# Altium schematic sheet down_converter_RF.SchDoc
size A3; DocumentNumber: 16; SheetNumber: 16; SheetTotal: 19
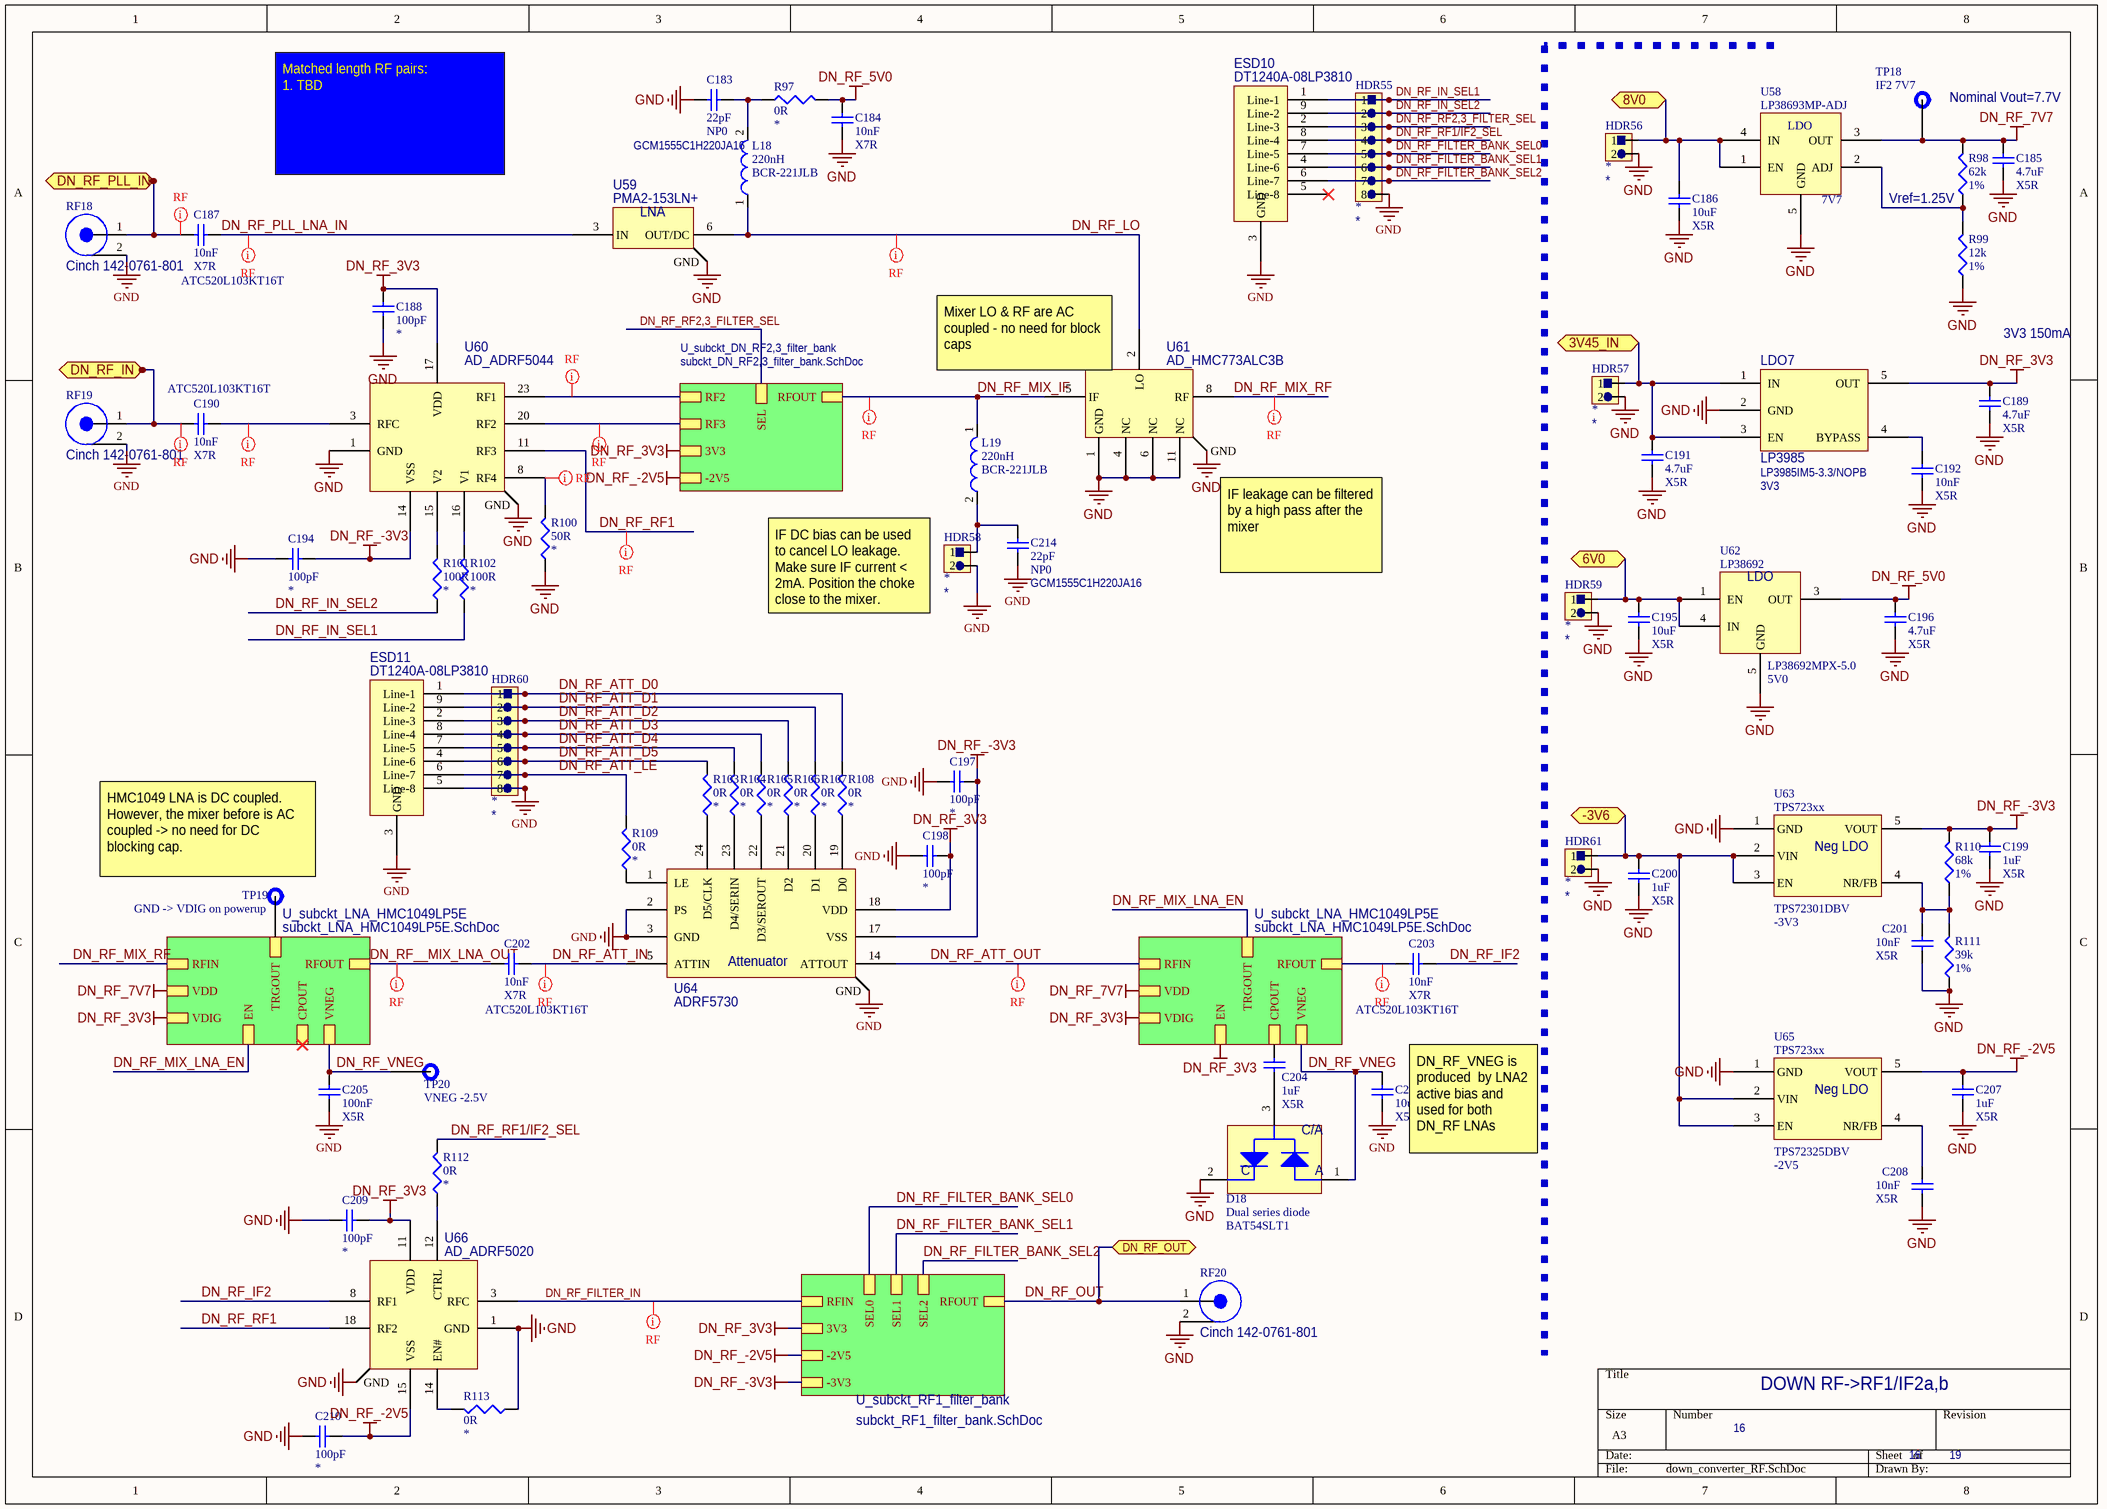
[diagram p0: down_converter_RF.SchDoc]

## Parts
C183  value 22pF  Dielectric: NP0  Model: GCM1555C1H220JA16  [TBD]  (hidden comment: Capacitor)
C184  value 10nF  Dielectric: X7R  [TBD]  (hidden comment: Capacitor)
C185  value 4.7uF  Dielectric: X5R  [CAP0603]  (hidden comment: Capacitor)
C186  value 10uF  Dielectric: X5R  [CAP0603]  (hidden comment: Capacitor)
C187  ATC520L103KT16T  value 10nF  Dielectric: X7R  [TBD]
C188  value 100pF  [TBD]  (hidden comment: Capacitor)
C189  value 4.7uF  Dielectric: X5R  [CAP0603]  (hidden comment: Capacitor)
C190  ATC520L103KT16T  value 10nF  Dielectric: X7R  [TBD]
C191  value 4.7uF  Dielectric: X5R  [CAP0603]  (hidden comment: Capacitor)
C192  value 10nF  Dielectric: X5R  [CAP0603]  (hidden comment: Capacitor)
C194  value 100pF  [TBD]  (hidden comment: Capacitor)
C195  value 10uF  Dielectric: X5R  [CAP0603]  (hidden comment: Capacitor)
C196  value 4.7uF  Dielectric: X5R  [TBD]  (hidden comment: Capacitor)
C197  value 100pF  [TBD]  (hidden comment: Capacitor)
C198  value 100pF  [TBD]  (hidden comment: Capacitor)
C199  value 1uF  Dielectric: X5R  [TBD]  (hidden comment: Capacitor)
C200  value 1uF  Dielectric: X5R  [CAP0603]  (hidden comment: Capacitor)
C201  value 10nF  Dielectric: X5R  [TBD]  (hidden comment: Capacitor)
C202  ATC520L103KT16T  value 10nF  Dielectric: X7R  [TBD]
C203  ATC520L103KT16T  value 10nF  Dielectric: X7R  [TBD]
C204  value 1uF  Dielectric: X5R  [CAP0603]  (hidden comment: Capacitor)
C205  value 100nF  Dielectric: X5R  [CAP0603]  (hidden comment: Capacitor)
C206  value 10uF  Dielectric: X5R  [CAP0603]  (hidden comment: Capacitor)
C207  value 1uF  Dielectric: X5R  [TBD]  (hidden comment: Capacitor)
C208  value 10nF  Dielectric: X5R  [TBD]  (hidden comment: Capacitor)
C209  value 100pF  [TBD]  (hidden comment: Capacitor)
C210  value 100pF  [TBD]  (hidden comment: Capacitor)
C214  value 22pF  Dielectric: NP0  Model: GCM1555C1H220JA16  [CAP0402]  (hidden comment: Capacitor)
D18  Dual series diode  Model: BAT54SLT1  [SOT23-3]
ESD10  DT1240A-08LP3810
ESD11  DT1240A-08LP3810
HDR55  Header 8 pins  [TBD]  (value not drawn)
HDR56  Header 2 pins  [JST ZH 2pin TH]  (value not drawn)
HDR57  Header 2 pins  [JST ZH 2pin TH]  (value not drawn)
HDR58  Header 2 pins  [JST ZH 2pin TH]  (value not drawn)
HDR59  Header 2 pins  [JST ZH 2pin TH]  (value not drawn)
HDR60  Header 8 pins  [TBD]  (value not drawn)
HDR61  Header 2 pins  [JST ZH 2pin TH]  (value not drawn)
L18  value 220nH  Model: BCR-221JLB  [TBD]  (hidden comment: Inductor)
L19  value 220nH  Model: BCR-221JLB  [TBD]  (hidden comment: Inductor)
LDO7  LP3985  Model: LP3985IM5-3.3/NOPB  Voltage: 3V3
R97  value 0R  [RES0603]  (hidden comment: Resistor)
R98  value 62k  Type: 1%  [RES0603]  (hidden comment: Resistor)
R99  value 12k  Type: 1%  [RES0603]  (hidden comment: Resistor)
R100  value 50R  [RES0603]  (hidden comment: Resistor)
R101  value 100R  [RES0603]  (hidden comment: Resistor)
R102  value 100R  [RES0603]  (hidden comment: Resistor)
R103  value 0R  [RES0603]  (hidden comment: Resistor)
R104  value 0R  [RES0603]  (hidden comment: Resistor)
R105  value 0R  [RES0603]  (hidden comment: Resistor)
R106  value 0R  [RES0603]  (hidden comment: Resistor)
R107  value 0R  [RES0603]  (hidden comment: Resistor)
R108  value 0R  [RES0603]  (hidden comment: Resistor)
R109  value 0R  [RES0603]  (hidden comment: Resistor)
R110  value 68k  Type: 1%  [RES0603]  (hidden comment: Resistor)
R111  value 39k  Type: 1%  [RES0603]  (hidden comment: Resistor)
R112  value 0R  [RES0603]  (hidden comment: Resistor)
R113  value 0R  [RES0603]  (hidden comment: Resistor)
RF18  Model: Cinch 142-0761-801  [TBD]  (hidden comment: RF connector w/ 2 pins)
RF19  Model: Cinch 142-0761-801  [TBD]  (hidden comment: RF connector w/ 2 pins)
RF20  Model: Cinch 142-0761-801  [TBD]  (hidden comment: RF connector w/ 2 pins)
TP18  IF2 7V7  [1XHeader 100mil]  (no BOM)
TP19  GND -> VDIG on powerup  [1XHeader 100mil]  (no BOM)
TP20  VNEG -2.5V  [1XHeader 100mil]  (no BOM)
U58  LDO  Model: LP38693MP-ADJ  Voltage: 7V7  [Model Name]
U59  PMA2-153LN+
U60  AD_ADRF5044
U61  AD_HMC773ALC3B
U62  LP38692  Model: LP38692MPX-5.0  Voltage: 5V0  [TBD]
U63  TPS723xx  Model: TPS72301DBV  Voltage: -3V3  [TBD]
U64  ADRF5730
U65  TPS723xx  Model: TPS72325DBV  Voltage: -2V5  [TBD]
U66  AD_ADRF5020

## Sub-sheets
U_subckt_DN_RF2,3_filter_bank = subckt_DN_RF2,3_filter_bank.SchDoc: RF2, RFOUT, SEL, 3V3, -2V5, RF3
U_subckt_LNA_HMC1049LP5E = subckt_LNA_HMC1049LP5E.SchDoc: RFIN, RFOUT, VDD, EN, VDIG, CPOUT, VNEG, TRGOUT
U_subckt_LNA_HMC1049LP5E = subckt_LNA_HMC1049LP5E.SchDoc: RFIN, RFOUT, VDD, EN, VDIG, CPOUT, VNEG, TRGOUT
U_subckt_RF1_filter_bank = subckt_RF1_filter_bank.SchDoc: 3V3, -3V3, RFIN, RFOUT, SEL0, SEL1, SEL2, -2V5

## Ports
3V45_IN, 6V0, 8V0, -3V6, DN_RF_IN, DN_RF_OUT, DN_RF_PLL_IN

## Nets
DN_RF_3V3: C188.2 C189.2 C198.1 C209.2 LDO7.5(OUT) U60.17(VDD) U64.18(VDD) U66.11(VDD) ; sheet U_subckt_DN_RF2,3_filter_bank/3V3, sheet U_subckt_LNA_HMC1049LP5E/VDIG, sheet U_subckt_LNA_HMC1049LP5E/EN, sheet U_subckt_LNA_HMC1049LP5E/VDIG, sheet U_subckt_RF1_filter_bank/3V3
DN_RF_5V0: C184.2 C196.2 R97.2 U62.3(OUT)
DN_RF_7V7: C185.2 R98.2 TP18.1 U58.3(OUT) ; sheet U_subckt_LNA_HMC1049LP5E/VDD, sheet U_subckt_LNA_HMC1049LP5E/VDD
DN_RF_-2V5: C207.2 C210.2 U65.5(VOUT) U66.15(VSS) ; sheet U_subckt_DN_RF2,3_filter_bank/-2V5, sheet U_subckt_RF1_filter_bank/-2V5
DN_RF_-3V3: C194.2 C197.1 C199.2 R110.2 U60.14(VSS) U63.5(VOUT) U64.17(VSS) ; sheet U_subckt_RF1_filter_bank/-3V3
GND: C183.1 C184.1 C185.1 C186.1 C188.1 C189.1 C191.1 C192.1 C194.1 C195.1 C196.1 C197.2 C198.2 C199.1 C200.1 C201.1 C205.1 C206.1 C207.1 C208.1 C209.1 C210.1 C214.2 D18.2(C) ESD10.3(GND) ESD11.3(GND) ESD11.5(Line-8) HDR55.8 HDR56.2 HDR57.2 HDR58.2 HDR59.2 HDR60.8 HDR61.2 LDO7.2(GND) R99.1 R100.1 R111.1 R113.1 RF18.2 RF19.2 RF20.2 U58.5(GND) U59.1(NC) U59.2(NC) U59.4(NC) U59.5(NC) U59.7(NC) U59.8(NC) U59.9(GND) U60.1(GND) U60.2(GND) U60.4(GND) U60.5(GND) U60.6(GND) U60.7(GND) U60.9(GND) U60.10(GND) U60.12(GND) U60.13(GND) U60.18(GND) U60.19(GND) U60.21(GND) U60.22(GND) U60.24(GND) U60.25(GND) U61.1(GND) U61.3(GND) U61.4(NC) U61.6(NC) U61.7(GND) U61.9(GND) U61.10(GND) U61.11(NC) U61.12(GND) U61.13(GND) U62.5(GND) U63.1(GND) U64.2(PS) U64.3(GND) U64.4(GND) U64.6(GND) U64.7(GND) U64.8(GND) U64.9(GND) U64.10(GND) U64.11(GND) U64.12(GND) U64.13(GND) U64.15(GND) U64.16(GND) U64.25(GND) U65.1(GND) U66.1(GND) U66.2(GND) U66.4(GND) U66.5(GND) U66.6(GND) U66.7(GND) U66.9(GND) U66.10(GND) U66.13(GND) U66.16(GND) U66.17(GND) U66.19(GND) U66.20(GND) U66.21(GND)
3V45_IN: C191.2 HDR57.1 LDO7.1(IN) LDO7.3(EN) ; port 3V45_IN
6V0: C195.2 HDR59.1 U62.1(EN) U62.4(IN) ; port 6V0
8V0: C186.2 HDR56.1 U58.1(EN) U58.4(IN) ; port 8V0
-3V6: C200.2 HDR61.1 U63.2(VIN) U63.3(EN) U65.2(VIN) U65.3(EN) ; port -3V6
DN_RF__MIX_LNA_OUT: C202.1 ; sheet U_subckt_LNA_HMC1049LP5E/RFOUT
DN_RF_ATT_D0: ESD11.1(Line-1) HDR60.1 R108.2
DN_RF_ATT_D1: ESD11.9(Line-2) HDR60.2 R107.2
DN_RF_ATT_D2: ESD11.2(Line-3) HDR60.3 R106.2
DN_RF_ATT_D3: ESD11.8(Line-4) HDR60.4 R105.2
DN_RF_ATT_D4: ESD11.7(Line-5) HDR60.5 R104.2
DN_RF_ATT_D5: ESD11.4(Line-6) HDR60.6 R103.2
DN_RF_ATT_IN: C202.2 U64.5(ATTIN)
DN_RF_ATT_LE: ESD11.6(Line-7) HDR60.7 R109.2
DN_RF_ATT_OUT: U64.14(ATTOUT) ; sheet U_subckt_LNA_HMC1049LP5E/RFIN
DN_RF_FILTER_BANK_SEL0: ESD10.7(Line-5) HDR55.5 ; sheet U_subckt_RF1_filter_bank/SEL0
DN_RF_FILTER_BANK_SEL1: ESD10.4(Line-6) HDR55.6 ; sheet U_subckt_RF1_filter_bank/SEL1
DN_RF_FILTER_BANK_SEL2: ESD10.6(Line-7) HDR55.7 ; sheet U_subckt_RF1_filter_bank/SEL2
DN_RF_FILTER_IN: U66.3(RFC) ; sheet U_subckt_RF1_filter_bank/RFIN
DN_RF_IF2: C203.2 U66.8(RF1)
DN_RF_IN: C190.1 RF19.1 ; port DN_RF_IN
DN_RF_IN_SEL1: ESD10.1(Line-1) HDR55.1 R102.1
DN_RF_IN_SEL2: ESD10.9(Line-2) HDR55.2 R101.1
DN_RF_LO: L18.1 U59.6(OUT/DC) U61.2(LO)
DN_RF_MIX_IF: L19.1 U61.5(IF) ; sheet U_subckt_DN_RF2,3_filter_bank/RFOUT
DN_RF_MIX_LNA_EN: sheet U_subckt_LNA_HMC1049LP5E/EN, sheet U_subckt_LNA_HMC1049LP5E/TRGOUT
DN_RF_MIX_RF: U61.8(RF) ; sheet U_subckt_LNA_HMC1049LP5E/RFIN
DN_RF_OUT: RF20.1 ; port DN_RF_OUT, sheet U_subckt_RF1_filter_bank/RFOUT
DN_RF_PLL_IN: C187.1 RF18.1 ; port DN_RF_PLL_IN
DN_RF_PLL_LNA_IN: C187.2 U59.3(IN)
DN_RF_RF1: U60.11(RF3) U66.18(RF2)
DN_RF_RF1/IF2_SEL: ESD10.8(Line-4) HDR55.4 R112.2
DN_RF_RF2,3_FILTER_SEL: ESD10.2(Line-3) HDR55.3 ; sheet U_subckt_DN_RF2,3_filter_bank/SEL
DN_RF_VNEG: C205.2 C206.2 D18.1(A) TP20.1 ; sheet U_subckt_LNA_HMC1049LP5E/VNEG, sheet U_subckt_LNA_HMC1049LP5E/VNEG
NetC183_2: C183.2 L18.2 R97.1
NetC190_2: C190.2 U60.3(RFC)
NetC192_2: C192.2 LDO7.4(BYPASS)
NetC201_2: C201.2 R110.1 R111.2 U63.4(NR/FB)
NetC203_1: C203.1 ; sheet U_subckt_LNA_HMC1049LP5E/RFOUT
NetC204_1: C204.1 D18.3(C/A)
NetC204_2: C204.2 ; sheet U_subckt_LNA_HMC1049LP5E/CPOUT
NetC208_2: C208.2 U65.4(NR/FB)
NetC214_1: C214.1 HDR58.1 L19.2
NetR98_1: R98.1 R99.2 U58.2(ADJ)
NetR100_2: R100.2 U60.8(RF4)
NetR101_2: R101.2 U60.15(V2)
NetR102_2: R102.2 U60.16(V1)
NetR103_1: R103.1 U64.24(D5/CLK)
NetR104_1: R104.1 U64.23(D4/SERIN)
NetR105_1: R105.1 U64.22(D3/SEROUT)
NetR106_1: R106.1 U64.21(D2)
NetR107_1: R107.1 U64.20(D1)
NetR108_1: R108.1 U64.19(D0)
NetR109_1: R109.1 U64.1(LE)
NetR112_1: R112.1 U66.12(CTRL)
NetR113_2: R113.2 U66.14(EN#)
NetTP19_1: TP19.1 ; sheet U_subckt_LNA_HMC1049LP5E/TRGOUT
NetU60_20: U60.20(RF2) ; sheet U_subckt_DN_RF2,3_filter_bank/RF3
NetU60_23: U60.23(RF1) ; sheet U_subckt_DN_RF2,3_filter_bank/RF2

Not connected (* = marked no-connect by the designer): ESD10 5(Line-8)*; U62 2(NC)

## Layout directives
net class RF: DN_RF__MIX_LNA_OUT, DN_RF_ATT_IN, DN_RF_ATT_OUT, DN_RF_FILTER_IN, DN_RF_IN, DN_RF_LO, DN_RF_MIX_IF, DN_RF_MIX_RF, DN_RF_PLL_IN, DN_RF_PLL_LNA_IN, DN_RF_RF1, NetC190_2, NetC203_1, NetR100_2, NetU60_20, NetU60_23

## Notes on the sheet
- (near TP18) Nominal Vout=7.7V
- Matched length RF pairs:
  1. TBD
- (near R98) Vref=1.25V
- (near U61) Mixer LO & RF are AC coupled - no need for block caps
- 3V3 150mA
- (near U61) IF leakage can be filtered by a high pass after the mixer
- IF DC bias can be used to cancel LO leakage. Make sure IF current < 2mA. Position the choke close to the mixer.
- (near TP19) HMC1049 LNA is DC coupled. However, the mixer before is AC coupled -> no need for DC blocking cap.
- (near C206) DN_RF_VNEG is produced  by LNA2 active bias and used for both DN_RF LNAs
- DOWN RF->RF1/IF2a,b
- (in symbol AD_ADRF5730) Attenuator
- (in symbol LP38692) LDO
- (in symbol minicircuits_PMA2-153LN+) LNA
- (in symbol TPS723xx) Neg LDO

## Library data of the parts
C187 C190 C202 C203 = Capacitor
D18 = D dual series diode
ESD10 ESD11 = DiodesInc_DT1240A-08LP3810: Diodes Incorporated 8ch 3.3V ESD diodes
HDR55 HDR60 = Header8: Pitch: *; Model: *
HDR56-HDR59 HDR61 = Header2: Pitch: *; Model: *
LDO7 = LP3985: LDO 150mA
RF18-RF20 = RF_connector: RF connector w/  pin and barrel
TP18-TP20 = Test point
U58 = LDO_Adj: Adjustable LDO
U59 = minicircuits_PMA2-153LN+: LNA 16.7dB 0.5GHz-15GHz
U60 = AD_ADRF5044: AD SP4T Switch, 100MHz-30GHz
U61 = AD_HMC773ALC3B: AD mixer HMC773ALC3B, 6GHz - 26GHz
U62 = LP38692: LDO LP38692
U63 U65 = TPS723xx: Adjustable negative voltage LDO
U64 = AD_ADRF5730: AD Attenuator, 0.5dB LSB, ADRF5730
U66 = AD_ADRF5020: AD SPDT Switch, 100MHz-30GHz
C183-C186 C188 C189 C191 C192 C194-C201 C204-C210 C214 = Capacitor
  C188 C194 C197 C198 C209 C210: Dielectric: *
R97-R113 = Resistor
  R97 R100-R109 R112 R113: Type: *